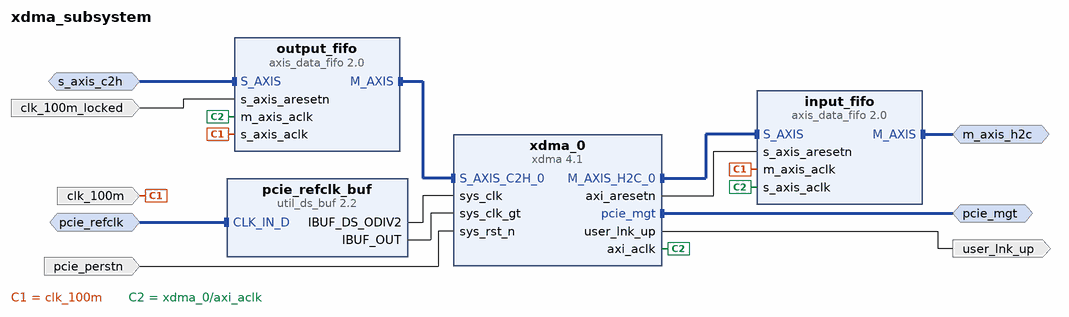
[diagram p0: block diagram of the top level]
# Vivado block design xdma_subsystem, xcku3p-ffvb676-2-e, Vivado 2024.2
create_bd_design xdma_subsystem

create_bd_intf_port -mode Master -vlnv xilinx.com:interface:pcie_7x_mgt_rtl:1.0 pcie_mgt
create_bd_intf_port -mode Slave -vlnv xilinx.com:interface:diff_clock_rtl:1.0 pcie_refclk
create_bd_intf_port -mode Master -vlnv xilinx.com:interface:axis_rtl:1.0 m_axis_h2c
create_bd_intf_port -mode Slave -vlnv xilinx.com:interface:axis_rtl:1.0 s_axis_c2h
set_property -dict [list \
  CONFIG.HAS_TKEEP 1 \
  CONFIG.HAS_TLAST 1 \
  CONFIG.HAS_TREADY 1 \
  CONFIG.HAS_TSTRB 0 \
  CONFIG.LAYERED_METADATA undef \
  CONFIG.TDATA_NUM_BYTES 16 \
  CONFIG.TDEST_WIDTH 0 \
  CONFIG.TID_WIDTH 0 \
  CONFIG.TUSER_WIDTH 0 \
] [get_bd_intf_ports s_axis_c2h]
create_bd_port -dir I -type clk clk_100m
set_property -dict {CONFIG.FREQ_HZ 100000000} [get_bd_ports clk_100m]
create_bd_port -dir I clk_100m_locked
create_bd_port -dir I -type rst pcie_perstn
create_bd_port -dir O user_lnk_up

create_bd_cell -type ip -vlnv xilinx.com:ip:xdma:4.1 xdma_0
set_property -dict [list \
  CONFIG.axi_data_width 128_bit \
  CONFIG.cfg_mgmt_if false \
  CONFIG.pf0_msi_enabled false \
  CONFIG.pf0_msix_enabled true \
  CONFIG.pl_link_cap_max_link_speed 8.0_GT/s \
  CONFIG.pl_link_cap_max_link_width X4 \
  CONFIG.xdma_axi_intf_mm AXI_Stream \
  CONFIG.xdma_num_usr_irq 1 \
  CONFIG.xdma_rnum_chnl 1 \
  CONFIG.xdma_wnum_chnl 1 \
] [get_bd_cells xdma_0]
create_bd_cell -type ip -vlnv xilinx.com:ip:axis_data_fifo:2.0 input_fifo
set_property -dict [list \
  CONFIG.FIFO_DEPTH 256 \
  CONFIG.HAS_TKEEP 1 \
  CONFIG.HAS_TLAST 1 \
  CONFIG.IS_ACLK_ASYNC 1 \
  CONFIG.TDATA_NUM_BYTES 16 \
] [get_bd_cells input_fifo]
create_bd_cell -type ip -vlnv xilinx.com:ip:axis_data_fifo:2.0 output_fifo
set_property -dict [list \
  CONFIG.FIFO_DEPTH 256 \
  CONFIG.HAS_TKEEP 1 \
  CONFIG.HAS_TLAST 1 \
  CONFIG.IS_ACLK_ASYNC 1 \
  CONFIG.TDATA_NUM_BYTES 16 \
] [get_bd_cells output_fifo]
create_bd_cell -type ip -vlnv xilinx.com:ip:util_ds_buf:2.2 pcie_refclk_buf
set_property -dict {CONFIG.C_BUF_TYPE IBUFDSGTE} [get_bd_cells pcie_refclk_buf]

# ---- connections ----

connect_bd_intf_net [get_bd_intf_ports m_axis_h2c] [get_bd_intf_pins input_fifo/M_AXIS]
connect_bd_intf_net [get_bd_intf_pins output_fifo/M_AXIS] [get_bd_intf_pins xdma_0/S_AXIS_C2H_0]
connect_bd_intf_net [get_bd_intf_ports pcie_refclk] [get_bd_intf_pins pcie_refclk_buf/CLK_IN_D]
connect_bd_intf_net [get_bd_intf_ports s_axis_c2h] [get_bd_intf_pins output_fifo/S_AXIS]
connect_bd_intf_net [get_bd_intf_pins xdma_0/M_AXIS_H2C_0] [get_bd_intf_pins input_fifo/S_AXIS]
connect_bd_intf_net [get_bd_intf_ports pcie_mgt] [get_bd_intf_pins xdma_0/pcie_mgt]
connect_bd_net [get_bd_ports clk_100m] [get_bd_pins input_fifo/m_axis_aclk] [get_bd_pins output_fifo/s_axis_aclk]
connect_bd_net [get_bd_ports clk_100m_locked] [get_bd_pins output_fifo/s_axis_aresetn]
connect_bd_net [get_bd_ports pcie_perstn] [get_bd_pins xdma_0/sys_rst_n]
connect_bd_net [get_bd_pins pcie_refclk_buf/IBUF_DS_ODIV2] [get_bd_pins xdma_0/sys_clk]
connect_bd_net [get_bd_pins pcie_refclk_buf/IBUF_OUT] [get_bd_pins xdma_0/sys_clk_gt]
connect_bd_net [get_bd_pins xdma_0/axi_aclk] [get_bd_pins input_fifo/s_axis_aclk] [get_bd_pins output_fifo/m_axis_aclk]
connect_bd_net [get_bd_pins xdma_0/axi_aresetn] [get_bd_pins input_fifo/s_axis_aresetn]
connect_bd_net [get_bd_pins xdma_0/user_lnk_up] [get_bd_ports user_lnk_up]

validate_bd_design
save_bd_design
